# EAGLE design ERpcukBOx (EAGLE 7.7.0)

## Sheet 1 of 2
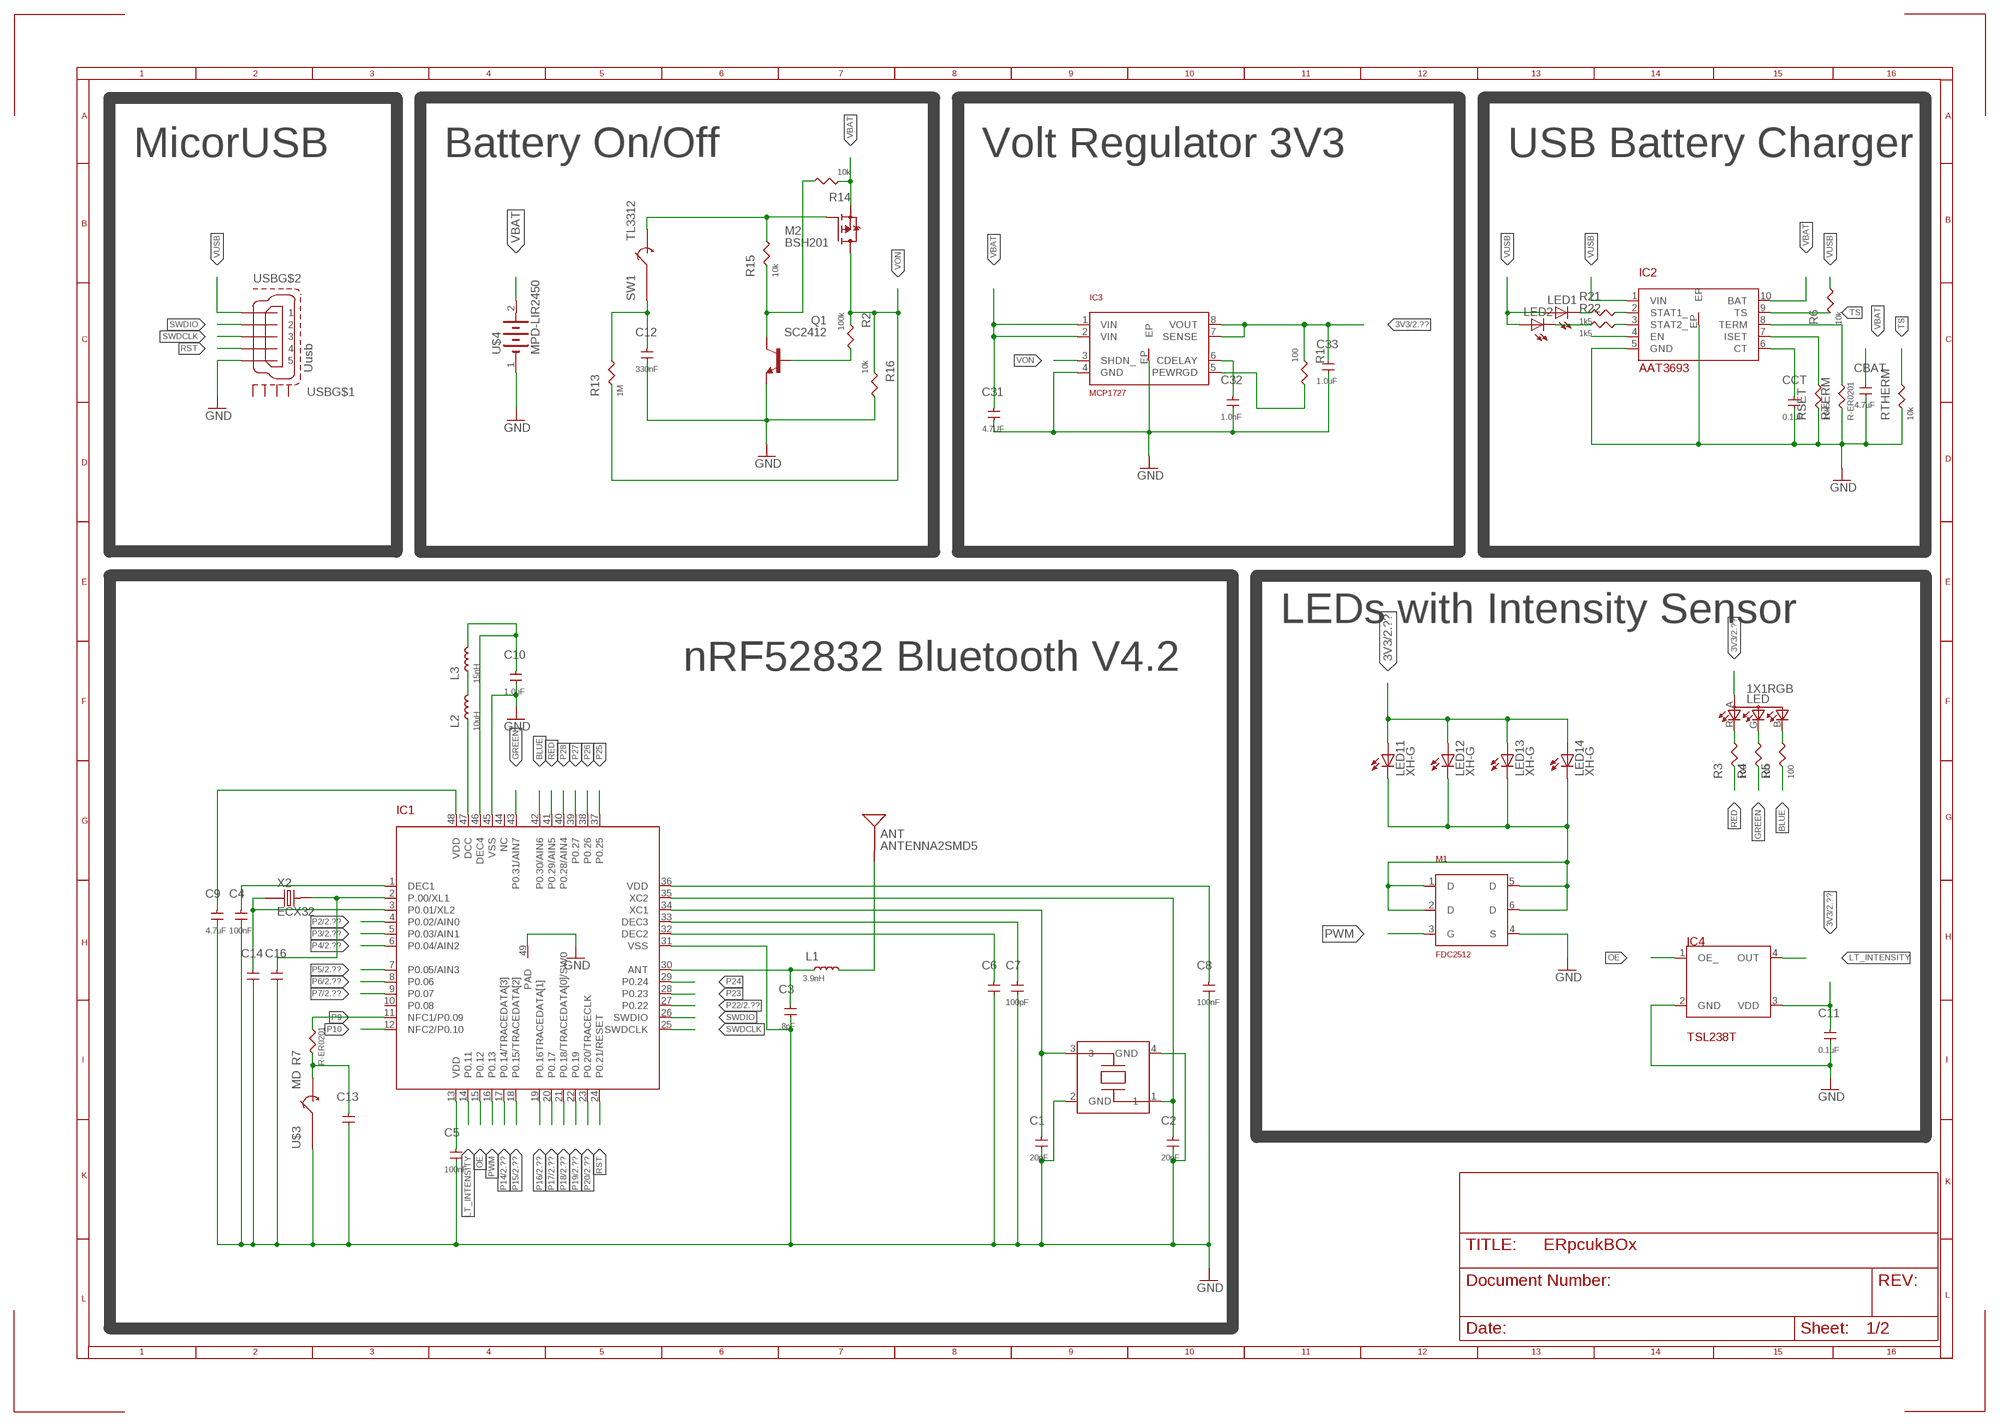
[diagram p0: schematic, sheet 1]

### Parts
ANT  ANTENNA2SMD5  [ANTENNA-CHIP5]
C1  20pF  C-ER201  [C0201]
C2  20pF  C-ER201  [C0201]
C3  .8pF  C-ER201  [C0201]
C4  100nF  C-ER201  [C0201]
C5  100nF  C-ER201  [C0201]
C6  C-ER201  [C0201]
C7  100pF  C-ER201  [C0201]
C8  100nF  C-ER201  [C0201]
C9  4.7uF  C-ERC0402  [C0402]
C10  1.0uF  C-ER201  [C0201]
C11  0.1uF  C-ER201  [C0201]
C12  330nF  C-ER201  [C0201]
C13  C-ER201  [C0201]
C14  C-ER201  [C0201]
C16  C-ER201  [C0201]
C31  4.7UF  C-ERC0402  [C0402]
C32  1.0nF  C-ER201  [C0201]
C33  1.0uF  C-ER201  [C0201]
CBAT  4.7uF  C-ERC0402  [C0402]
CCT  0.1uF  C-ER201  [C0201]
IC1  NRF52832  [QFN48]
IC2  AAT3693  [AAT3693]
IC3  MCP1727  [DFN8-3X3]
IC4  TSL238T  [T4]
L1  3.9nH  L-ER0201  [C0201]
L2  10uH  L-ERL603  [R0603]
L3  15nH  L-ER0201  [C0201]
LED  1X1RGB  [1X1]
LED1  LEDCHIP-LED0603  [CHIP-LED0603]
LED2  LEDCHIP-LED0603  [CHIP-LED0603]
LED11  XH-G  [XH-G]
LED12  XH-G  [XH-G]
LED13  XH-G  [XH-G]
LED14  XH-G  [XH-G]
M1  FDC2512  [SSOT6]
M2  BSH201  [SOT23]
Q1  SC2412  [SC59-BEC]
R1  100  R-ER0201  [R0201]
R2  100k  R-ER0201  [R0201]
R3  100  R-ER0201  [R0201]
R4  100  R-ER0201  [R0201]
R5  100  R-ER0201  [R0201]
R6  10k  R-ER0201  [R0201]
R7  R-ER0201  [R0201]
R13  1M  R-ER0201  [R0201]
R14  10k  R-ER0201  [R0201]
R15  10k  R-ER0201  [R0201]
R16  10k  R-ER0201  [R0201]
R21  1k5  R-ER0201  [R0201]
R22  1k5  R-ER0201  [R0201]
RSET  16k5  R-ER0201  [R0201]
RTERM  R-ER0201  [R0201]
RTHERM  10k  R-ER0201  [R0201]
SW1  TL3312  [TL3312]
U$3  MD  [MD]
U$4  MPD-LIR2450  [LIR2450]
USB  Uusb  MICRO-USB-SHIELD-ZX62R-B-5P  [ZX62R-B-5P]
X1  FA-128  [FA-128]
X2  ECX32  [ECX39]

### Nets
3V3: C5.2 C8.2 C9.2 C11.2 C33.2 IC1.13(VDD) IC1.36(VDD) IC1.48(VDD) IC3.7(SENSE) IC3.8(VOUT) IC4.3(VDD) LED11.2(A) LED12.2(A) LED13.2(A) LED14.2(A) LED.A(A2) R1.1 ; also sheet 2
BLUE: IC1.42(P0.30/AIN6) R5.1
GND: C1.1 C2.1 C3.1 C4.1 C5.1 C6.1 C7.1 C8.1 C9.1 C10.1 C11.1 C12.1 C13.1 C14.1 C16.1 C31.1 C32.1 C33.1 CBAT.1 CCT.1 IC1.31(VSS) IC1.45(VSS) IC1.49(PAD) IC2.5(GND) IC2.EP IC3.4(GND) IC3.EP IC4.2(GND) M1.4(S) Q1.E R16.2 RSET.1 RTERM.1 RTHERM.1 U$3.P$1 U$4.1(-) USB.1 X1.2(GND) X1.4(GND) ; also sheet 2
GREEN: IC1.43(P0.31/AIN7) R4.1
LT_INTENSITY: IC1.14(P0.11) IC4.4(OUT)
N$2: LED11.1(C) LED12.1(C) LED13.1(C) LED14.1(C) M1.1(D) M1.2(D) M1.5(D) M1.6(D)
N$3: Q1.B R2.2
N$4: C3.2 IC1.30(ANT) L1.1
N$5: C6.2 IC1.32(DEC2)
N$6: ANT.FEED(SIGNAL) L1.2
N$7: C7.2 IC1.33(DEC3)
N$8: C1.2 IC1.34(XC1) X1.3
N$9: C2.2 IC1.35(XC2) X1.1
N$10: Q1.C R14.2 R15.1
N$11: IC1.47(DCC) L2.1
N$12: L2.2 L3.1
N$13: C10.2 IC1.46(DEC4) L3.2
N$15: C12.2 R13.2 SW1.1
N$16: LED.B(CGREEN) R5.2
N$17: CCT.2 IC2.6(CT)
N$18: IC2.7(ISET) RSET.2
N$19: IC2.8(TERM) RTERM.2
N$20: IC2.3(STAT2_) R22.2
N$21: IC2.2(STAT1_) R21.2
N$22: LED1.C R21.1
N$23: LED2.C R22.1
N$24: LED.G(CBLUE) R4.2
N$25: IC3.5(PEWRGD) R1.2
N$26: LED.R(CRED) R3.2
N$27: C32.2 IC3.6(CDELAY)
N$28: M2.1(G) R15.2 SW1.3
N$31: C16.2 IC1.2(P.00/XL1) X2.P$2
N$32: C14.2 IC1.3(P0.01/XL2) X2.P$1
N$34: C13.2 R7.1 U$3.P$2
N$36: C4.2 IC1.1(DEC1)
OE: IC1.15(P0.12) IC4.1(OE_)
P2: IC1.4(P0.02/AIN0) ; also sheet 2
P3: IC1.5(P0.03/AIN1) ; also sheet 2
P4: IC1.6(P0.04/AIN2) ; also sheet 2
P5: IC1.7(P0.05/AIN3) ; also sheet 2
P6: IC1.8(P0.06) ; also sheet 2
P7: IC1.9(P0.07) ; also sheet 2
P9: IC1.11(NFC1/P0.09) R7.2
P10: IC1.12(NFC2/P0.10)
P14: IC1.17(P0.14/TRACEDATA[3]) ; also sheet 2
P15: IC1.18(P0.15/TRACEDATA[2]) ; also sheet 2
P16: IC1.19(P0.16TRACEDATA[1]) ; also sheet 2
P17: IC1.20(P0.17) ; also sheet 2
P18: IC1.21(P0.18/TRACEDATA[0]/SW0) ; also sheet 2
P19: IC1.22(P0.19) ; also sheet 2
P20: IC1.23(P0.20/TRACECLK) ; also sheet 2
P22: IC1.27(P0.22) ; also sheet 2
P23: IC1.28(P0.23)
P24: IC1.29(P0.24)
P25: IC1.37(P0.25)
P26: IC1.38(P0.26)
P27: IC1.39(P0.27)
P28: IC1.40(P0.28/AIN4)
PWM: IC1.16(P0.13) M1.3(G)
RED: IC1.41(P0.29/AIN5) R3.1
RST: IC1.24(P0.21/RESET) USB.2
SWDCLK: IC1.25(SWDCLK) USB.3
SWDIO: IC1.26(SWDIO) USB.4
TS: IC2.9(TS) R6.1 RTHERM.2
VBAT: C31.2 CBAT.2 IC2.10(BAT) IC3.1(VIN) IC3.2(VIN) M2.2(S) R14.1 U$4.2(+)
VON: IC3.3(SHDN_) M2.3(D) R2.1 R13.1 R16.1
VUSB: IC2.1(VIN) IC2.4(EN) LED1.A LED2.A R6.2 USB.5
Unconnected: IC1.10(P0.08) IC1.44(NC) USB.M1(S1) USB.M2(S2) USB.M3(S3) USB.M4(S4)

### Notes on the sheet
- MicorUSB | Battery On/Off | Volt Regulator 3V3 | USB Battery Charger
- LEDs with Intensity Sensor
- nRF52832 Bluetooth V4.2

## Sheet 2 of 2
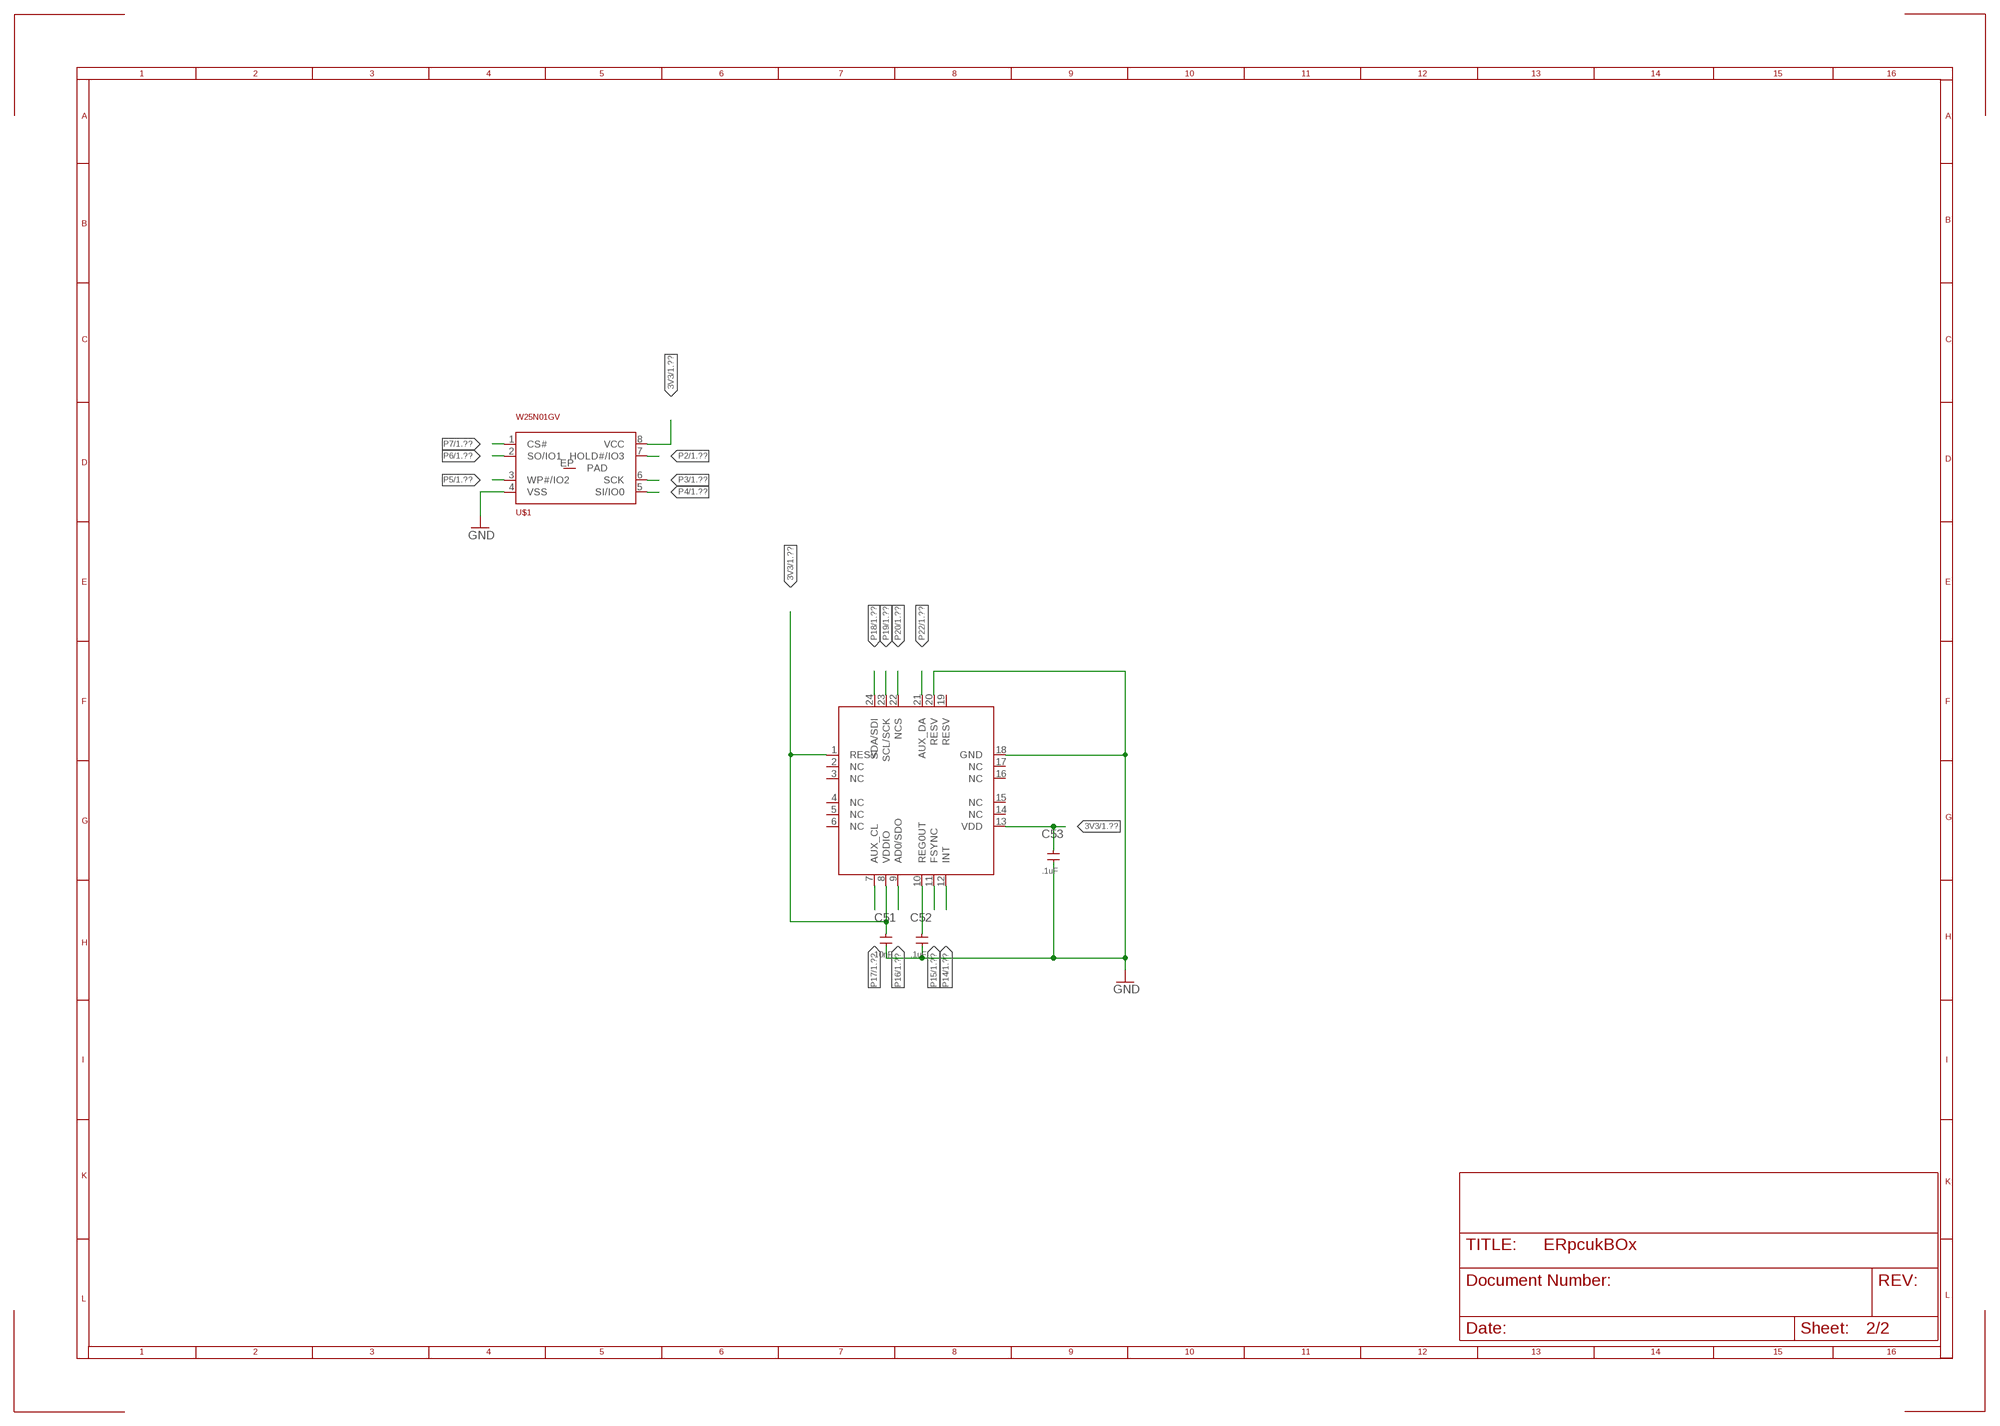
[diagram p1: schematic, sheet 2]

### Parts
C51  10nF  C-ER201  [C0201]
C52  .1uF  C-ER201  [C0201]
C53  .1uF  C-ER201  [C0201]
IC5  MPU9250  MPU9250_CORRECTED  [3X3_24_QFN_CORRECTED]
U$1  W25N01GV  [8WSON6X8]

### Nets
3V3: C51.2 C53.2 IC5.1(RESV) IC5.8(VDDIO) IC5.13(VDD) U$1.8(VCC) ; also sheet 1
GND: C51.1 C52.1 C53.1 IC5.18(GND) IC5.20(RESV) U$1.4(VSS) ; also sheet 1
N$33: C52.2 IC5.10(REG0UT)
P2: U$1.7(HOLD#/IO3) ; also sheet 1
P3: U$1.6(SCK) ; also sheet 1
P4: U$1.5(SI/IO0) ; also sheet 1
P5: U$1.3(WP#/IO2) ; also sheet 1
P6: U$1.2(SO/IO1) ; also sheet 1
P7: U$1.1(CS#) ; also sheet 1
P14: IC5.12(INT) ; also sheet 1
P15: IC5.11(FSYNC) ; also sheet 1
P16: IC5.9(AD0/SDO) ; also sheet 1
P17: IC5.7(AUX_CL) ; also sheet 1
P18: IC5.24(SDA/SDI) ; also sheet 1
P19: IC5.23(SCL/SCK) ; also sheet 1
P20: IC5.22(NCS) ; also sheet 1
P22: IC5.21(AUX_DA) ; also sheet 1
Unconnected: IC5.2(NC) IC5.3(NC) IC5.4(NC) IC5.5(NC) IC5.6(NC) IC5.14(NC) IC5.15(NC) IC5.16(NC) IC5.17(NC) IC5.19(RESV) U$1.EP(PAD)

## Library data of the parts
ANT = SparkFun:ANTENNA2: Antenna Single endded antenna. Common with smaller chip antennas. CHIP4 package is the GPS Chip Antenna SKU: GPS-08418. CHIP5 package is 2.4GHz chip antenna SKU: WRL-00144.
C1-C14 C16 C31-C33 C51-C53 CBAT CCT = rcl:C-ER
IC1 = Nordic:NRF52832
IC2 = skyworks:AAT3693
IC3 = microchip:MCP1727
IC4 = AMS:TSL238T
IC5 = invensense:MPU9250_CORRECTED
L1-L3 = rcl:L-ER
LED = led:1X1RGB
LED1 LED2 = led:LED: LED OSRAM: - CHIPLED LG R971, LG N971, LY N971, LG Q971, LY Q971, LO R971, LY R971 LH N974, LH R974 LS Q976, LO Q976, LY Q976 LO Q996 - Hyper CHIPLED LW Q18S LB Q993, LB Q99A, LB R99A - SideLED LS A670, LO A670, LY A670, LG A670, LP A670 LB A673, LV A673, LT A673, LW A673 LH A674 LY A675 LS A676, LA A676, LO A676, LY A676, LW A676 LS A679, LY A679, LG A679 - Hyper Micro SIDELED® LS Y876, LA Y876, LO Y876, LY Y876 LT Y87S - SmartLED LW L88C, LW L88S LB L89C, LB L89S, LG L890 LS L89K, LO L89K, LY L89K LS L896, LA L896, LO L896, LY L896 - TOPLED LS T670, LO T670, LY T670, LG T670, LP T670 LSG T670, LSP T670, LSY T670, LOP T670, LYG T670 LG T671, LOG T671, LSG T671 LB T673, LV T673, LT T673, LW T673 LH T674 LS T676, LA T676, LO T676, LY T676, LB T676, LH T676, LSB T676, LW T676 LB T67C, LV T67C, LT T67C, LS T67K, LO T67K, LY T67K, LW E67C LS E67B, LA E67B, LO E67B, LY E67B, LB E67C, LV E67C, LT E67C LW T67C LS T679, LY T679, LG T679 LS T770, LO T770, LY T770, LG T770, LP T770 LB T773, LV T773, LT T773, LW T773 LH T774 LS E675, LA E675, LY E675, LS T675 LS T776, LA T776, LO T776, LY T776, LB T776 LHGB T686 LT T68C, LB T68C - Hyper Mini TOPLED® LB M676 - Mini TOPLED Santana® LG M470 LS M47K, LO M47K, LY M47K Source: http://www.osram.convergy.de LUXEON: - LUMILED® LXK2-PW12-R00, LXK2-PW12-S00, LXK2-PW14-U00, LXK2-PW14-V00 LXK2-PM12-R00, LXK2-PM12-S00, LXK2-PM14-U00 LXK2-PE12-Q00, LXK2-PE12-R00, LXK2-PE12-S00, LXK2-PE14-T00, LXK2-PE14-U00 LXK2-PB12-K00, LXK2-PB12-L00, LXK2-PB12-M00, LXK2-PB14-N00, LXK2-PB14-P00, LXK2-PB14-Q00 LXK2-PR12-L00, LXK2-PR12-M00, LXK2-PR14-Q00, LXK2-PR14-R00 LXK2-PD12-Q00, LXK2-PD12-R00, LXK2-PD12-S00 LXK2-PH12-R00, LXK2-PH12-S00 LXK2-PL12-P00, LXK2-PL12-Q00, LXK2-PL12-R00 Source: www.luxeon.com KINGBRIGHT: KA-3528ASYC Source: www.kingbright.com
LED11-LED14 = led:XH-G
M1 = transistor-fet:FDC2512
M2 = transistor-fet:BSH201
Q1 = transistor-npn:SC2412
R1-R7 R13-R16 R21 R22 RSET RTERM RTHERM = rcl:R-ER
SW1 = switch-omron:TL3312; DIGIKEY: EG4620CT-ND
U$1 = st-microelectronics:W25N01GV
U$3 = switch-omron:MD; DIGIKEY: 401-1932-ND
U$4 = battery:MPD-LIR2450
USB = con-hirose:MICRO-USB-SHIELD-: Hirose Micro USB Connector ZX62R-B-5P: Micro B, reverse (top mount) shell SMT Supplier: DigiKey H11574CT-ND Source: http://www.hirose.co.jp/cataloge_hp/e24200011.pdf
X1 = crystal:FA-128
X2 = crystal:ECX32

## Board
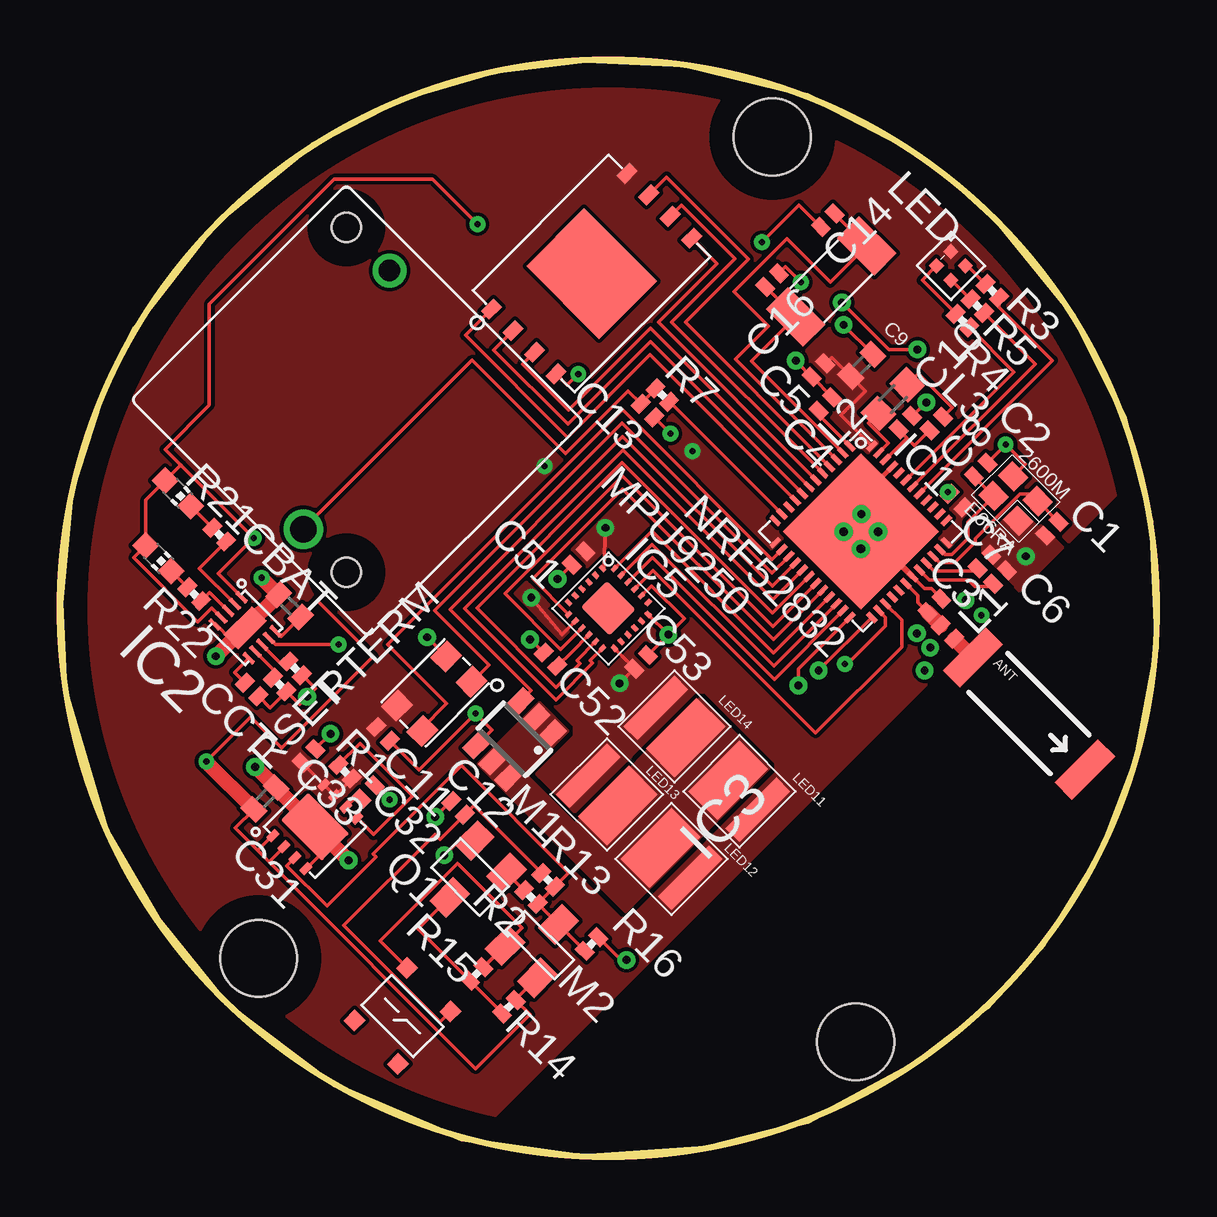
[diagram p2: board, top side]
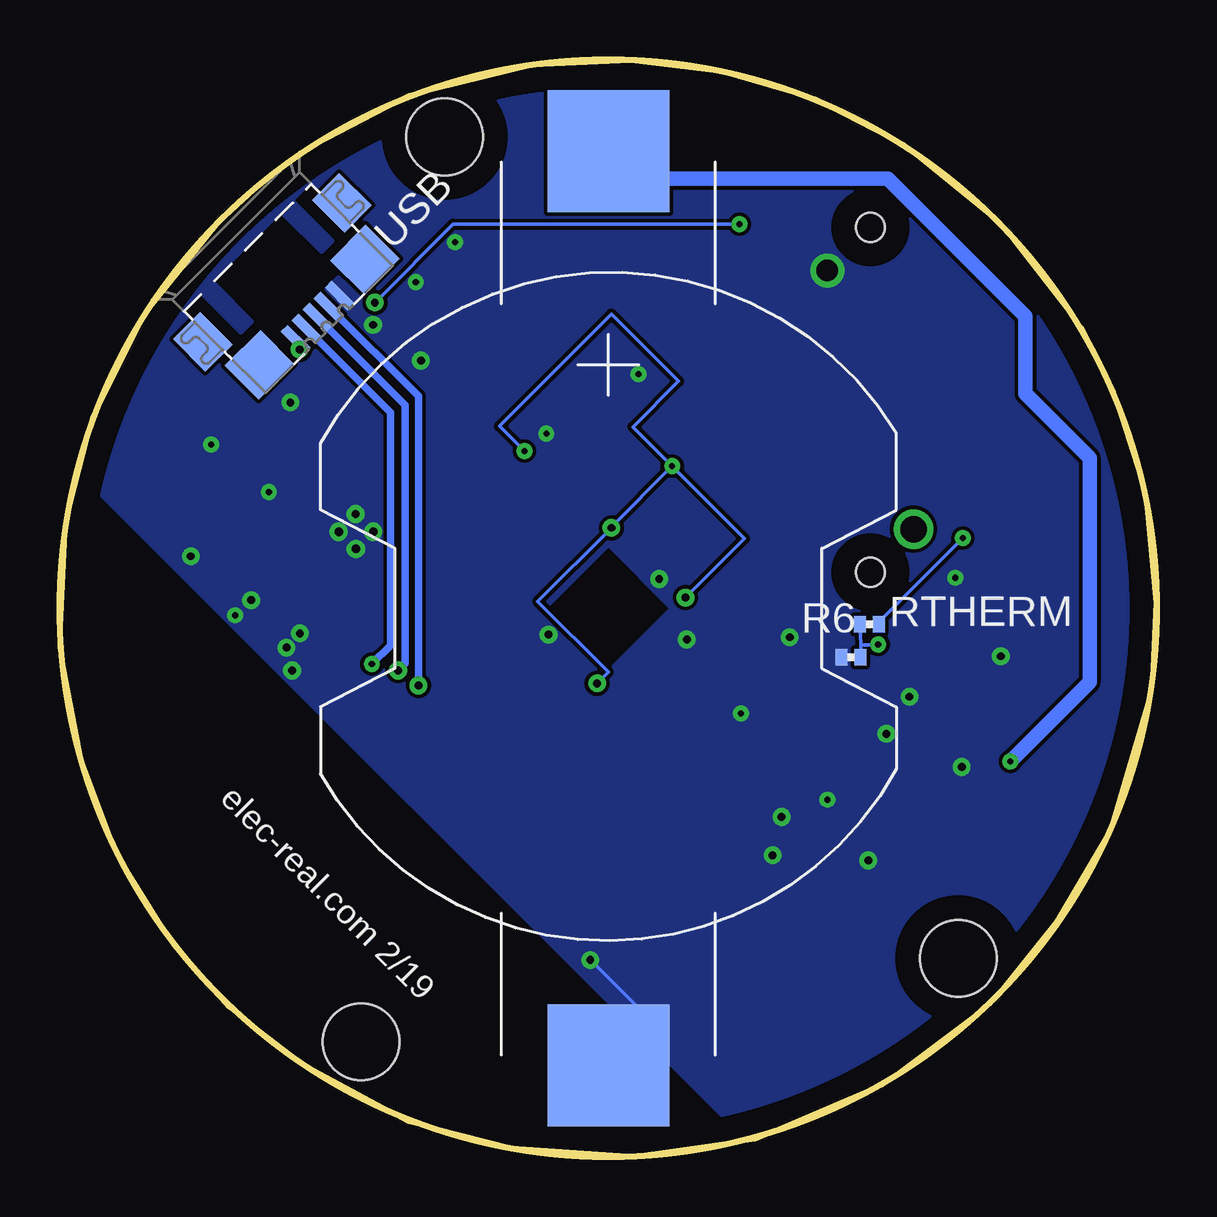
[diagram p3: board, bottom side, seen from below]

Size 45.72 x 45.72 mm. Coordinates in mm from the lower left corner, seen from the top.
Outline: circle at 22.86,22.86 radius 22.86
Copper layers (1*16): Top 0.035mm / dielectric 1.5mm / Bottom 0.035mm
Design rules "default *": minimum track width 6mil, minimum drill 10mil, track to track 6mil, track to pad 6mil, pad to pad 6mil, via to via 6mil, smd to smd 6mil, copper to edge 40mil, drill to drill 8mil, minimum pad ring 10mil, minimum via ring 8mil, stop-mask expansion 2mil, vias tented up to drill 0mil, thermal gap 10mil
Holes 3.2 mm at 29.68,42.51 33.17,4.79 8.28,8.28
Milling: 32 lines

### Footprints (pad centres in the part's own frame; a part is rotated, then mirrored left to right if it is on the bottom)
ANTENNA-CHIP5 = smd 1.016 x 2.54: FEED -3.302,0; NC 3.302,0
C0201 = smd 0.5 x 0.7: 1 -0.4,0; 2 0.4,0
C0402 = smd 0.7 x 0.9: 1 -0.65,0; 2 0.65,0
QFN48 = smd 0.5 x 0.2: 1 -2.85,2.2; 2 -2.85,1.8; 3 -2.85,1.4; 4 -2.85,1; 5 -2.85,0.6; 6 -2.85,0.2; 7 -2.85,-0.2; 8 -2.85,-0.6; 9 -2.85,-1; 10 -2.85,-1.4; 11 -2.85,-1.8; 12 -2.85,-2.2; 25 2.85,-2.2; 26 2.85,-1.8; 27 2.85,-1.4; 28 2.85,-1; 29 2.85,-0.6; 30 2.85,-0.2; 31 2.85,0.2; 32 2.85,0.6; 33 2.85,1; 34 2.85,1.4; 35 2.85,1.8; 36 2.85,2.2 | smd 0.2 x 0.5: 13 -2.2,-2.85; 14 -1.8,-2.85; 15 -1.4,-2.85; 16 -1,-2.85; 17 -0.6,-2.85; 18 -0.2,-2.85; 19 0.2,-2.85; 20 0.6,-2.85; 21 1,-2.85; 22 1.4,-2.85; 23 1.8,-2.85; 24 2.2,-2.85; 37 2.2,2.85; 38 1.8,2.85; 39 1.4,2.85; 40 1,2.85; 41 0.6,2.85; 42 0.2,2.85; 43 -0.2,2.85; 44 -0.6,2.85; 45 -1,2.85; 46 -1.4,2.85; 47 -1.8,2.85; 48 -2.2,2.85 | smd 4.6 x 4.6: 49 0,0
AAT3693 = smd 0.6 x 0.2: 1 -1,0.8; 2 -1,0.4; 3 -1,0; 4 -1,-0.4; 5 -1,-0.8; 6 1,-0.8; 7 1,-0.4; 8 1,0; 9 1,0.4; 10 1,0.8 | smd 0.9 x 1.7: EP 0,0
DFN8-3X3 = smd 0.5 x 0.3: 1 -1.5,0.975; 2 -1.5,0.325; 3 -1.5,-0.325; 4 -1.5,-0.975; 5 1.5,-0.975; 6 1.5,-0.325; 7 1.5,0.325; 8 1.5,0.975 | smd 1.6 x 2.4: EP 0,0
T4 = smd 1 x 0.9: 1 -1.45,0.75; 2 -1.45,-0.75; 3 1.45,-0.75; 4 1.45,0.75
3X3_24_QFN_CORRECTED = smd 0.3 x 0.2: 1 -1.35,1; 2 -1.35,0.6; 3 -1.35,0.2; 4 -1.35,-0.2; 5 -1.35,-0.6; 6 -1.35,-1; 13 1.35,-1; 14 1.35,-0.6; 15 1.35,-0.2; 16 1.35,0.2; 17 1.35,0.6; 18 1.35,1 | smd 0.2 x 0.3: 7 -1,-1.35; 8 -0.6,-1.35; 9 -0.2,-1.35; 10 0.2,-1.35; 11 0.6,-1.35; 12 1,-1.35; 19 1,1.35; 20 0.6,1.35; 21 0.2,1.35; 22 -0.2,1.35; 23 -0.6,1.35; 24 -1,1.35 | smd 1.7 x 1.54: P$2 0,0
R0603 = smd 1 x 1.1: 1 -0.85,0; 2 0.85,0
1X1 = smd 0.45 x 0.45: A 0.425,0.425; B -0.425,-0.425; G -0.425,0.425; R 0.425,-0.425
CHIP-LED0603 = smd 0.8 x 0.8: A 0,-0.75; C 0,0.75
XH-G = smd 1.7 x 3: 1 -0.65,0 | smd 0.8 x 3: 2 1.1,0
SSOT6 = smd 0.69 x 0.99: 1 -0.95,-1.3; 2 0,-1.3; 3 0.95,-1.3; 4 0.95,1.3; 5 0,1.3; 6 -0.95,1.3
SOT23 = smd 1 x 1.4: 1 -0.95,-1.1; 2 0.95,-1.1; 3 0,1.1
SC59-BEC = smd 1 x 1.4: B -0.95,-1.2; C 0,1.2; E 0.95,-1.2
R0201 = smd 0.5 x 0.7: 1 -0.4,0; 2 0.4,0
TL3312 = smd 0.66 x 0.635: 1 -1.549,1.28; 2 1.549,1.28; 3 -1.549,-1.28; 4 1.549,-1.28
8WSON6X8 = smd 0.75 x 0.5: 1 -4,1.905; 2 -4,0.635; 3 -4,-0.635; 4 -4,-1.905; 5 4,-1.905; 6 4,-0.635; 7 4,0.635; 8 4,1.905 | smd 3.404 x 4.293: EP 0,0
MD = drill 0.9: P$1 -5.08,-2.54 | drill 1.1: P$2 5.08,2.54 | hole 1.2: -5.08,-5.08; 5.08,5.08
LIR2450 = smd 5.08 x 5.08: 1 -19.05,0; 2 19.05,0
ZX62R-B-5P = smd 1.35 x 0.4: 1 2.675,1.3; 2 2.675,0.65; 3 2.675,0; 4 2.675,-0.65; 5 2.675,-1.3 | smd 1.9 x 1.6: M1 0,-4.1; M2 0,4.1 | smd 2 x 2.1: M3 2.35,3.1; M4 2.35,-3.1
FA-128 = smd 0.95 x 0.85: 1 -0.725,-0.575; 2 0.725,-0.575; 3 0.725,0.575; 4 -0.725,0.575
ECX39 = smd 1.3 x 2.2: P$1 -2.1,0; P$2 2.1,0

### Placement (x,y rotation side)
ANT  40.39,18.48 315 top
C1  41.34,26.18 45 top
C2  38.38,28.64 225 top
C3  36.46,22.99 225 top
C4  31.91,31.37 225 top
C5  31.61,32.79 45 top
C6  39.19,24.17 225 top
C7  38.54,24.82 225 top
C8  37.37,27.35 315 top
C9  33.42,32.99 225 top
C10  35.23,30.6 225 top
C11  13.47,17.63 135 top
C12  16.59,14.54 315 top
C13  24.49,31.1 135 top
C14  32,39.04 45 top
C16  29.68,36.55 225 top
C31  8.55,14.94 225 top
C32  12.84,15.21 225 top
C33  10.36,16.72 225 top
C51  21.62,24.96 45 top
C52  20.45,20.74 315 top
C53  24.22,20.63 225 top
CBAT  9.57,22.97 315 top
CCT  7.99,19.48 135 top
IC1  33.38,26.06 315 top
IC2  7.72,22.05 315 top
IC3  10.63,13.75 45 top
IC4  15.6,19.3 225 top
IC5  22.86,22.86 315 top
L1  36.99,21.87 315 top
L2  34.71,31.59 45 top
L3  36.53,30.57 225 top
LED  37.14,37.14 45 top
LED1  4.92,27.66 225 top
LED2  4.11,24.94 225 top
LED11  28.32,15.24 315 top
LED12  25.49,12.41 315 top
LED13  22.79,15.11 135 top
LED14  25.62,17.93 135 top
M1  18.94,17.4 135 top
M2  20,8.91 315 top
Q1  17.09,11.66 135 top
R1  11.89,16.05 135 top
R2  19.63,10.83 135 top
R3  38.86,36.1 135 top
R4  37.62,34.86 135 top
R5  38.23,35.47 135 top
R6  11.98,22.2 0 bottom
R7  25.11,31.75 315 top
R13  20.35,11.54 135 top
R14  18.71,6.25 225 top
R15  17.36,7.63 45 top
R16  22.16,8.87 45 top
R21  6.64,25.93 315 top
R22  5.6,23.45 315 top
RSET  9.16,19.68 135 top
RTERM  9.8,20.36 135 top
RTHERM  12.75,20.82 0 bottom
SW1  14.27,5.87 225 top
U$1  22.16,36.82 45 top
U$3  11.94,31.55 225 top
U$4  22.86,22.86 90 bottom
USB  36.87,36.87 315 bottom
X1  39.83,27.44 315 top
X2  32.15,36.49 225 top

### Tracks (layer width: path | path; a pad name or v marks a point on that pad's centre or on a via)
3V3  (via drill 0.25, 0.33)
  Top 0.152: R1.1 IC3.7 IC3.8 C33.2 | IC1.48 32.56,30.91 33.56,31.91 C9.2 32.17,33.32 C5.2 | IC5.1 22.68,24.59 v22.73,26.22 | v23.33,19.73 C53.2 IC5.13 | IC5.8 20.93,21.78 v19.64,23.31
  Bottom 0.152: v19.64,23.31 17.18,25.77 v20.2,28.79 | v23.33,19.73 22.86,20.2 25.81,23.15 v22.73,26.22 22.75,26.24 v20.2,28.79 | v26.36,29.42 27.4,30.46 22.73,35.13 19.93,32.33 21.84,30.42 v20.2,28.79
  pour Top (rank 2, no thermals): -9.47,22.86 22.86,-9.47 55.19,22.86 22.86,55.19
BLUE
  Top 0.152: IC1.42 40.66,33.05 R5.1
GND  (via drill 0.25, 0.33, 0.34, 0.36)
  Top 0.152: IC1.31 36.04,23.69 36.33,23.69 C3.1 | IC3.4 11.32,13.06 11.65,12.73 | C33.1 v11.28,17.63 | IC2.5 6.47,22.22 7.16,21.53 | RTERM.1 10.65,19.52 v10.31,19.18 9.98,18.86 RSET.1 8.76,18.72 CCT.1 | C12.1 v15.64,14.17 | Q1.E 16.95,13.5 v16.02,12.57 | C52.1 v19.59,21.57 | C51.1 v20.74,24.08 | C53.1 v25.36,21.76 | v25.36,21.76 25.36,21.77 | v25.36,21.76 26.02,22.43 24.65,23.8 IC5.20 | R16.2 23.39,8.2 v23.61,8.2 | C9.1 33.88,33.46 v32.67,34.68 | C4.1 C5.1 30.73,33.1 v30.67,33.19 | C10.1 v36.12,31.45 | IC5.18 v25.36,21.76 | 33.74,26.42 IC1.49 | IC4.2 v15.3,21.66 | X1.4 40.24,28.87 v39.42,29.68 C2.1 | M1.4 18,17.8 v17.33,18.48 14.97,16.12 C11.1 | C32.1 v13.74,14.89 13.7,14.89 | C8.1 v37.01,27.71 | C16.1 30.24,37.1 v30.89,36.46 | C14.1 30.8,39.68 v29.25,38.13 | U$1.4 21.14,32.17 v21.6,32.63 | C13.1 v25.45,30.15
  Top 0.178: 33.88,25.84 v34.1,26.06 33.74,26.42 | IC1.45 33.4,27.49 v33.4,26.79 | 6.47,20.84 IC2.EP
  Top 0.22: IC1.31 34.1,25.62 arc-90 v34.1,26.06
  Top 0.61: 8.15,16.25 C31.1 arc90 9.01,15.38 IC3.EP 11.65,12.73 v12.03,12.35 | 6.47,20.84 7.16,21.53 | v8.4,24.14 CBAT.1 IC2.EP
  Bottom 0.152: U$4.1 23.37,4.32 21.55,6.14 v23.61,8.2
  other vias: 32.67,26.06 33.38,25.34 8.13,16.25 6.5,20.87 37.75,23.2 36.28,21.23 36.04,20.27 35.72,21.82 40.26,25.03 38.41,22.57
  pour Bottom (no thermals): -9.47,22.86 22.86,-9.47 55.19,22.86 22.86,55.19
  pour Top (no thermals): 39.85,23.72 39.99,23.58 41.81,25.39 40.89,26.31 40.78,26.2 39.9,27.08 38.47,25.64 38.47,25.18 39.85,23.79
GREEN
  Top 0.152: IC1.43 39.76,32.72 R4.1
LT_INTENSITY
  Top 0.152: IC1.14 29.69,24.91 23.45,31.14 13.66,21.35 16.12,18.89 15.05,17.81 IC4.4
N$1
  cutout Top: 53.21,18.37 27.35,-7.49 18.19,1.67 44.05,27.53
N$2
  pour Top (no thermals): 19.99,18.94 17.42,16.38 23.58,10.22 29.58,16.21 26.69,19.11 21.46,13.88 19.38,15.96 21.17,17.76
N$3
  Top 0.152: Q1.B R2.2
N$4
  Top 0.152: IC1.30 35.76,23.4 35.76,23.11 C3.2
  Top 0.61: C3.2 L1.1
N$5
  Top 0.152: IC1.32 36.24,24.05 37.88,24.05 38.14,23.78 38.79,23.78 C6.2
N$6
  Top 0.61: L1.2 ANT.FEED
N$7
  Top 0.152: IC1.33 36.43,24.42 38.14,24.42 C7.2
N$8
  Top 0.152: IC1.34 36.66,24.76 37.3,24.76 38.16,25.63 38.16,25.77 40.01,27.62 40.47,27.62 X1.3 C1.2
N$9
  Top 0.152: IC1.35 36.88,25.11 37.17,25.11 37.84,25.77 37.84,26.45 38.91,27.53 X1.1 C2.2
N$10
  Top 0.152: R14.2 18.45,5.98 R15.1 14.93,9.5 Q1.C
N$11
  Top 0.152: IC1.47 34.54,29.75 33.71,30.58 L2.1
N$12
  Top 0.152: L3.1 37.19,31.23 35.77,32.65 L2.2
N$13
  Top 0.152: IC1.46 35.31,29.96 | 35.31,29.96 C10.2 | L3.2 35.62,29.65 35.31,29.96
N$14
  cutout Bottom: 53.21,18.37 27.35,-7.49 18.19,1.67 44.05,27.53
N$15
  Top 0.152: R13.2 17.25,14.64 C12.2 15.85,13.24 15.64,13.45 11.83,9.64 15.85,5.63 SW1.1
N$16
  Top 0.152: LED.B 37.15,36.55 R5.2
N$17
  Top 0.152: IC2.6 7.28,20.2 CCT.2
N$18
  Top 0.152: IC2.7 9.04,20.17 RSET.2
N$19
  Top 0.152: IC2.8 9.32,20.45 RTERM.2
N$20
  Top 0.152: IC2.3 6.24,23.53 R22.2
N$21
  Top 0.152: IC2.2 5.81,24.53 R21.2
N$22
  Top 0.152: R21.1 LED1.C
N$23
  Top 0.152: R22.1 LED2.C
N$24
  Top 0.152: LED.G 35.94,36.54 R4.2
  Top 0.178: LED.G 36.52,37.15
N$25
  Top 0.152: IC3.5 13.07,13.43 14.69,15.05 12.5,17.23 R1.2
N$26
  Top 0.152: LED.R 37.82,37.14 R3.2
N$27
  Top 0.152: IC3.6 12.41,15.07 C32.2
N$28
  Top 0.152: M2.1 R15.2 19.27,9.53 16.57,12.23 13.34,8.99 SW1.3
N$29
  cutout Top: 22.86,25.37 25.37,22.86 22.86,20.35 20.35,22.86
N$30
  cutout Bottom: 22.86,25.37 25.37,22.86 22.86,20.35 20.35,22.86
N$31
  Top 0.152: IC1.2 28.82,33.17 X2.P$2 C16.2
N$32
  Top 0.152: IC1.3 28.16,33.26 29.52,34.62 28.09,36.06 30.3,38.27 32.11,36.46 X2.P$1 C14.2
N$33
  Top 0.152: C52.2 21.31,21.03 IC5.10
N$34
  Top 0.152: R7.1 24.84,32.02 C13.2 23.69,31.91 21.08,29.31 17.18,33.2 U$3.P$2
N$36
  Top 0.152: IC1.1 31.55,31.01 C4.2
OE
  Top 0.152: IC1.15 29.68,24.34 23.43,30.58 15.62,22.77 17.89,20.51 IC4.1
P2
  Top 0.152: U$1.7 25.29,40.84 28.7,37.43 26.06,34.79 IC1.4
P3
  Top 0.152: U$1.6 25.91,39.67 28.14,37.44 25.49,34.8 IC1.5
P4
  Top 0.152: U$1.5 27.39,37.24 24.94,34.78 IC1.6
P5
  Top 0.152: U$1.3 19.29,33.04 21.21,31.12 24.62,34.54 IC1.7
P6
  Top 0.152: U$1.2 18.08,33.64 21.17,30.55 24.61,33.98 IC1.8
P7
  Top 0.152: U$1.1 16.9,34.25 21.15,29.99 24.6,33.43 IC1.9
P9
  Top 0.152: IC1.11 25.41,31.49 R7.2
P14
  Top 0.152: IC1.17 29.71,23.23 23.47,29.47 16.86,22.86 20.67,19.05 22.2,20.58 22.09,20.68 IC5.12
P15
  Top 0.152: IC1.18 29.7,22.66 23.43,28.93 17.38,22.88 20.69,19.57 21.68,20.56 21.54,20.69 IC5.11
P16
  Top 0.152: IC1.19 29.72,22.11 23.45,28.37 18.55,23.47 20.87,21.15 IC5.9
P17
  Top 0.152: IC1.20 29.73,21.56 23.45,27.84 19.71,24.1 IC5.7
P18
  Top 0.152: IC1.21 29.75,21 24.67,26.08 IC5.24
P19
  Top 0.152: IC1.22 29.76,20.45 24.68,25.53 IC5.23
P20
  Top 0.152: IC1.23 29.77,19.9 24.69,24.98 IC5.22
P22
  Top 0.152: IC1.27 35.09,22.37 35.09,21.26 31.5,17.67 24.73,24.44 IC5.21
PWM
  Top 0.152: IC1.16 29.7,23.78 23.45,30.03 16.25,22.82 19.64,19.44 M1.3
RED
  Top 0.152: R3.1 39.15,35.42 41.37,33.19 IC1.41
RST  (via drill 0.33)
  Top 0.152: v30.78,19.64 30.78,20.34 IC1.24
  Top 0.178: 32.92,22.47 IC1.24
  Bottom 0.305: USB.2 30.78,31.7 v30.78,19.64
SWDCLK  (via drill 0.33)
  Top 0.152: v31.62,20.27 IC1.25
  Bottom 0.305: USB.3 31.34,31.34 31.34,20.56 v31.62,20.27
SWDIO  (via drill 0.25)
  Top 0.152: IC1.26 34.41,22.49 34.41,22.12 32.85,20.56 v32.72,20.54
  Bottom 0.305: USB.4 31.95,31.03 31.95,21.32 v32.72,20.54
TS  (via drill 0.25)
  Top 0.152: IC2.9 8.98,21.35 v11.62,21.35
  Bottom 0.152: RTHERM.2 12.34,21.33 | 12.34,21.33 R6.1 | v11.62,21.35 11.63,21.33 12.34,21.33
VBAT  (via drill 0.25)
  Top 0.152: IC3.2 8.71,12.3 | 8.71,12.3 8.24,12.77 | 8.24,12.77 7.31,13.7 C31.2 | IC3.1 8.87,13.39 8.24,12.77 | IC2.10 9.21,21.69 CBAT.2 10.71,23.19 13.05,20.85 9.25,17.04 7.95,18.33 v6.1,16.48 | M2.2 18.99,6.56 R14.1 19.59,5.94 17.33,3.68 8.71,12.3
  Top 0.61: v6.1,16.48 6.1,16.46 C31.2
  Bottom 0.61: U$4.2 21.72,40.77 11.2,40.77 5.47,35.04 5.47,31.8 2.8,29.13 2.8,19.79 v6.1,16.48
VON
  Top 0.152: R16.1 M2.3 R2.1 R13.1 21.2,11.84 16.73,16.3 13.05,12.62 13.18,12.5 11.13,10.45 9.46,12.12 IC3.3
VUSB  (via drill 0.25, 0.33)
  Top 0.152: v32.59,35.61 34.55,33.65 v35.74,33.65 | IC2.1 6.6,24.31 v8.08,25.79 5.03,28.83 | 5.03,28.83 LED1.A 3.58,27.38 LED2.A 3.08,24.97 5.74,22.3 6.32,22.88 IC2.4 | 5.05,28.83 5.03,28.83 | v17.4,38.88 15.53,40.75 11.44,40.75 6.23,35.54 6.23,31.34 4.38,29.49 5.03,28.83
  Bottom 0.152: v32.59,35.61 29.33,38.88 v17.4,38.88 | R6.2 11.58,22.29 v8.08,25.79
  Bottom 0.305: USB.5 36.17,34.3 35.74,33.87 v35.74,33.65

### Text on the board
tPlace: IC2 | IC3
bPlace: elec-real.com 2/19